# Altium schematic sheet schematic.SchDoc
size 145 x 94 mm; Origin: Eagle
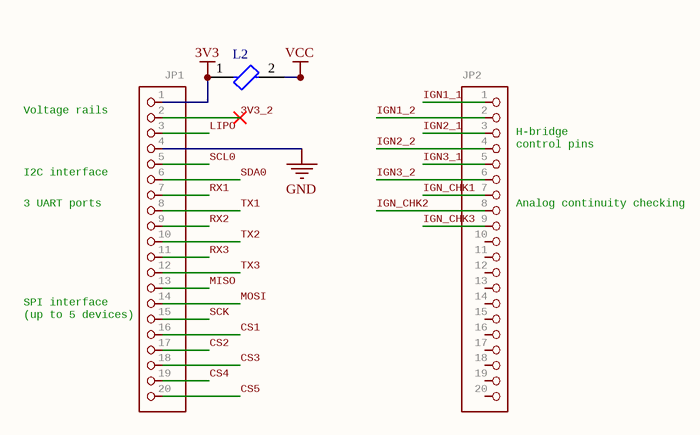
[diagram p0: schematic.SchDoc]

## Parts
JP1  PINHD-1X20  [1X20]  (value not drawn)
JP2  PINHD-1X20  [1X20]  (value not drawn)
L2  BLM18EG601SN1D  [FP-BLM18-0_15-t0_8-MFG]  (value not drawn)

## Nets
3V3: JP1.1 L2.1
GND: JP1.4
VCC: L2.2
3V3_2: JP1.2
CS1: JP1.16
CS2: JP1.17
CS3: JP1.18
CS4: JP1.19
CS5: JP1.20
IGN1_1: JP2.1
IGN1_2: JP2.2
IGN2_1: JP2.3
IGN2_2: JP2.4
IGN3_1: JP2.5
IGN3_2: JP2.6
IGN_CHK1: JP2.7
IGN_CHK2: JP2.8
IGN_CHK3: JP2.9
LIPO: JP1.3
MISO: JP1.13
MOSI: JP1.14
RX1: JP1.7
RX2: JP1.9
RX3: JP1.11
SCK: JP1.15
SCL0: JP1.5
SDA0: JP1.6
TX1: JP1.8
TX2: JP1.10
TX3: JP1.12

Not connected (* = marked no-connect by the designer): JP2 10 11 12 13 14 15 16 17 18 19 20

## Notes on the sheet
- (near JP1) Voltage rails
- (near JP1) I2C interface
- (near JP2) H-bridge
  control pins
- (near JP1) 3 UART ports
- (near JP2) Analog continuity checking
- (near JP1) SPI interface
  (up to 5 devices)

## Library data of the parts
JP1 JP2 = PINHD-1X20: PIN HEADER; GateName_1: A; SymbolName_1: PINHD20; LibraryName: adafruit; DeviceSetName: PINHD-1X20
L2 = CMP-0686-00354-3: Chip Ferrite Bead, 0603, 600Ω @ 100MHz, 0.35Ω, 25%, 500mA; Manufacturer Series: BLM18E; Number of Lines: 1; DC Resistance (DCR): 350mR; Impedance: 600R; Material: Steel; Shielding: Unshielded; Package Quantity: 1; Case/Package: 0603; Length: 1.6mm; Packaging: Tape and Reel; Resistance: 350mR; REACH SVHC: No SVHC; Military Standard: Not; Contact Plating: Tin; Termination: SMD/SMT; Number of Circuits: 1; Width: 0.8mm; Test Frequency: 100MHz; DC Current: 500mA; Case Code (Metric): 1608; Max DC Current: 500mA; Max Operating Temperature: 125°C; Current Rating: 500mA; Series: BLM18E; Tolerance: 25%; Min Operating Temperature: -55°C; Frequency: 100MHz; Lead Free: Lead Free; Terminal Finish: Tin; Number of Pins: 2; Max Current Rating: 500mA; Radiation Hardening: No; Case Code (Imperial): 0603; Number of Functions: 1; Depth: 0.8mm; DC Resistance-Max: 350mR; Height: 0.8mm; Core Material: Ferrite; RoHS Compliant: Yes; LCSC Part #: C20345